# Altium schematic sheet CPU.SchDoc
size A3; PageSetup: Record=PageOptions|CenterHorizontal=True|CenterVertical=True|PrintScale=1.04|XCorrection=1.00|YCorrection=1.00|PrintKind=0|BorderSize=5000000|LeftOffset=0|BottomOffset=0|Orientation=2|PaperLength=1000|PaperWidth=1000|Scale=100|PaperSource=7|PrintQuality=-3|MediaType=1|DitherType=10|PrintScaleMode=1|PaperKind=A3|PaperIndex=8
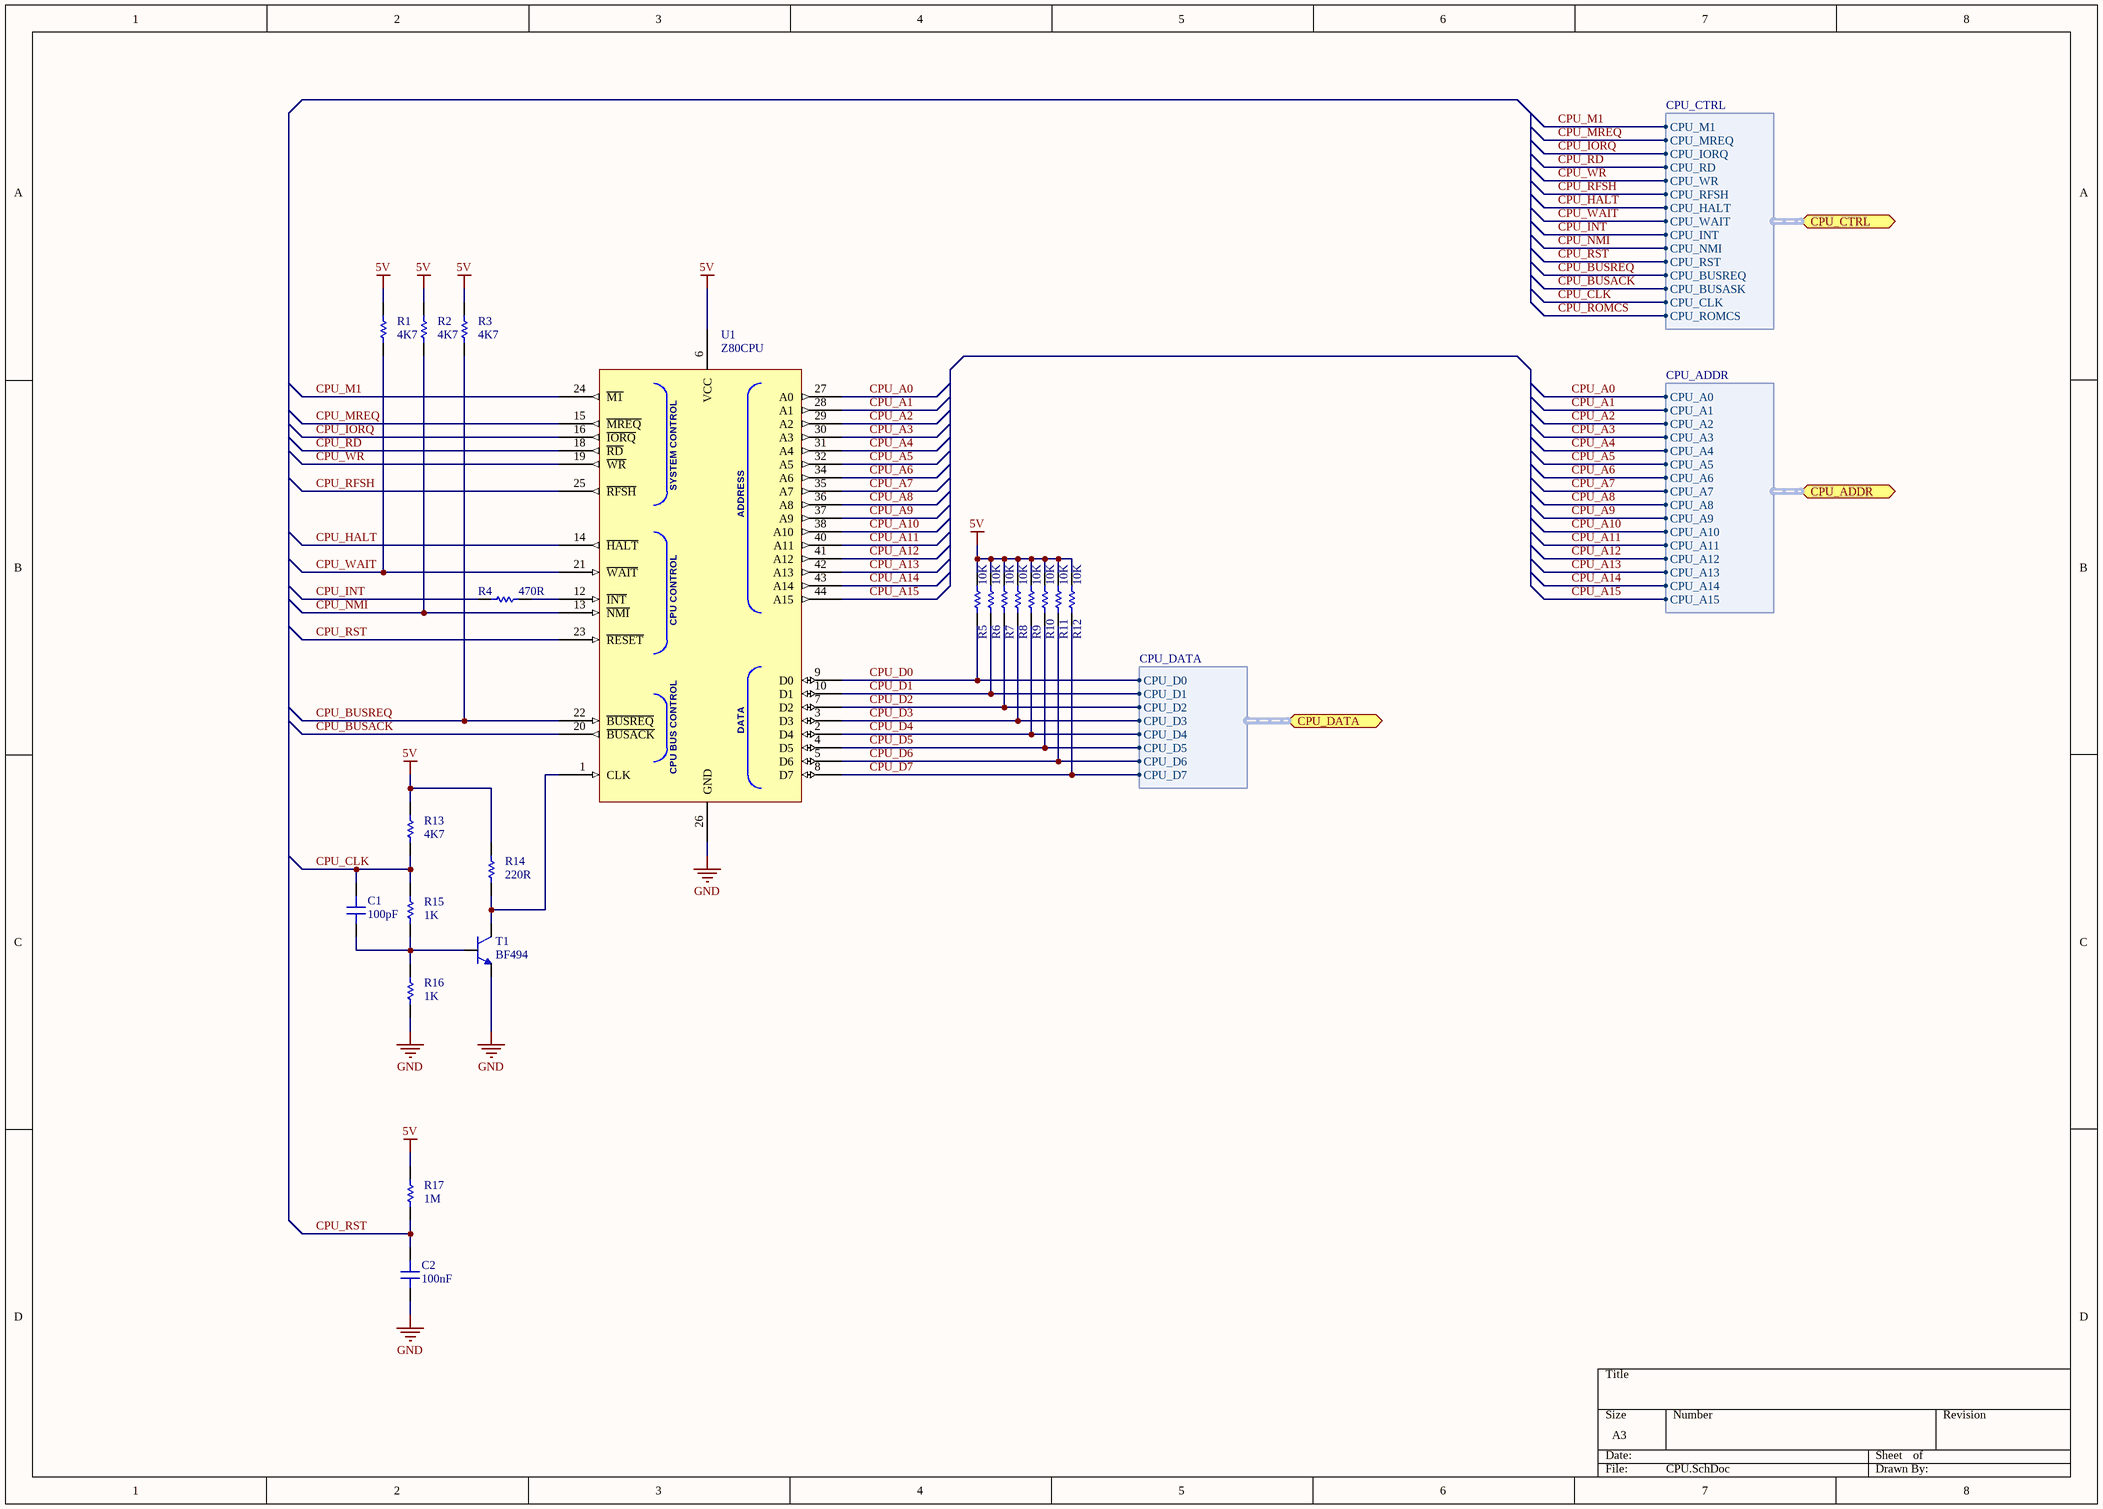
[diagram p0: CPU.SchDoc]

## Parts
C1  100pF  [0805]
C2  100nF  [0805]
R1  4K7  [0805]
R2  4K7  [0805]
R3  4K7  [0805]
R4  470R  [0805]
R5  10K  [0805]
R6  10K  [0805]
R7  10K  [0805]
R8  10K  [0805]
R9  10K  [0805]
R10  10K  [0805]
R11  10K  [0805]
R12  10K  [0805]
R13  4K7  [0805]
R14  220R  [0805]
R15  1K  [0805]
R16  1K  [0805]
R17  1M  [0805]
T1  BF494  [TO-92]
U1  Z80CPU  [Z84C00XXAEG]

## Ports
CPU_ADDR (harness CPU_ADDR), CPU_CTRL (harness CPU_CTRL), CPU_DATA (harness CPU_DATA)

## Harnesses
CPU_DATA: CPU_D0, CPU_D1, CPU_D2, CPU_D3, CPU_D4, CPU_D5, CPU_D6, CPU_D7
CPU_ADDR: CPU_A0, CPU_A1, CPU_A2, CPU_A3, CPU_A4, CPU_A5, CPU_A6, CPU_A7, CPU_A8, CPU_A9, CPU_A10, CPU_A11, CPU_A12, CPU_A13, CPU_A14, CPU_A15
CPU_CTRL: CPU_M1, CPU_MREQ, CPU_IORQ, CPU_RD, CPU_WR, CPU_RFSH, CPU_HALT, CPU_WAIT, CPU_INT, CPU_NMI, CPU_RST, CPU_BUSREQ, CPU_BUSASK, CPU_CLK, CPU_ROMCS

## Nets
5V: R1.2 R2.2 R3.2 R5.2 R6.2 R7.2 R8.2 R9.2 R10.2 R11.2 R12.2 R13.2 R14.2 R17.2 U1.6(VCC)
GND: C2.1 R16.1 T1.2 U1.26(GND)
CPU_A0: U1.27(A0) ; port CPU_ADDR.CPU_A0
CPU_A1: U1.28(A1) ; port CPU_ADDR.CPU_A1
CPU_A2: U1.29(A2) ; port CPU_ADDR.CPU_A2
CPU_A3: U1.30(A3) ; port CPU_ADDR.CPU_A3
CPU_A4: U1.31(A4) ; port CPU_ADDR.CPU_A4
CPU_A5: U1.32(A5) ; port CPU_ADDR.CPU_A5
CPU_A6: U1.34(A6) ; port CPU_ADDR.CPU_A6
CPU_A7: U1.35(A7) ; port CPU_ADDR.CPU_A7
CPU_A8: U1.36(A8) ; port CPU_ADDR.CPU_A8
CPU_A9: U1.37(A9) ; port CPU_ADDR.CPU_A9
CPU_A10: U1.38(A10) ; port CPU_ADDR.CPU_A10
CPU_A11: U1.40(A11) ; port CPU_ADDR.CPU_A11
CPU_A12: U1.41(A12) ; port CPU_ADDR.CPU_A12
CPU_A13: U1.42(A13) ; port CPU_ADDR.CPU_A13
CPU_A14: U1.43(A14) ; port CPU_ADDR.CPU_A14
CPU_A15: U1.44(A15) ; port CPU_ADDR.CPU_A15
CPU_BUSACK: U1.20(~{BUSACK}) ; port CPU_CTRL.CPU_BUSASK
CPU_BUSREQ: R3.1 U1.22(~{BUSREQ}) ; port CPU_CTRL.CPU_BUSREQ
CPU_CLK: C1.2 R13.1 R15.2 ; port CPU_CTRL.CPU_CLK
CPU_D0: R5.1 U1.9(D0) ; port CPU_DATA.CPU_D0
CPU_D1: R6.1 U1.10(D1) ; port CPU_DATA.CPU_D1
CPU_D2: R7.1 U1.7(D2) ; port CPU_DATA.CPU_D2
CPU_D3: R8.1 U1.3(D3) ; port CPU_DATA.CPU_D3
CPU_D4: R9.1 U1.2(D4) ; port CPU_DATA.CPU_D4
CPU_D5: R10.1 U1.4(D5) ; port CPU_DATA.CPU_D5
CPU_D6: R11.1 U1.5(D6) ; port CPU_DATA.CPU_D6
CPU_D7: R12.1 U1.8(D7) ; port CPU_DATA.CPU_D7
CPU_HALT: U1.14(~{HALT}) ; port CPU_CTRL.CPU_HALT
CPU_INT: R4.1 ; port CPU_CTRL.CPU_INT
CPU_IORQ: U1.16(~{IORQ}) ; port CPU_CTRL.CPU_IORQ
CPU_M1: U1.24(~{M1}) ; port CPU_CTRL.CPU_M1
CPU_MREQ: U1.15(~{MREQ}) ; port CPU_CTRL.CPU_MREQ
CPU_NMI: R2.1 U1.13(~{NMI}) ; port CPU_CTRL.CPU_NMI
CPU_RD: U1.18(~{RD}) ; port CPU_CTRL.CPU_RD
CPU_RFSH: U1.25(~{RFSH}) ; port CPU_CTRL.CPU_RFSH
CPU_ROMCS: port CPU_CTRL.CPU_ROMCS
CPU_RST: C2.2 R17.1 U1.23(~{RESET}) ; port CPU_CTRL.CPU_RST
CPU_WAIT: R1.1 U1.21(~{WAIT}) ; port CPU_CTRL.CPU_WAIT
CPU_WR: U1.19(~{WR}) ; port CPU_CTRL.CPU_WR
NetC1_1: C1.1 R15.1 R16.2 T1.1
NetR4_2: R4.2 U1.12(~{INT})
NetR14_1: R14.1 T1.3 U1.1(CLK)

Not connected (* = marked no-connect by the designer): U1 11(NC_0) 17(NC_1) 33(NC_2) 39(NC_3)

## Notes on the sheet
- (in symbol Z84C00xxAEG) SYSTEM CONTROL; ADDRESS; CPU CONTROL; DATA; CPU BUS CONTROL

## Library data of the parts
C1 C2 = Capacitor
R1-R17 = Resistor
T1 = BF494: NPN Medium Frequency Transistors
U1 = Z84C00xxAEG: Z80 - CPU